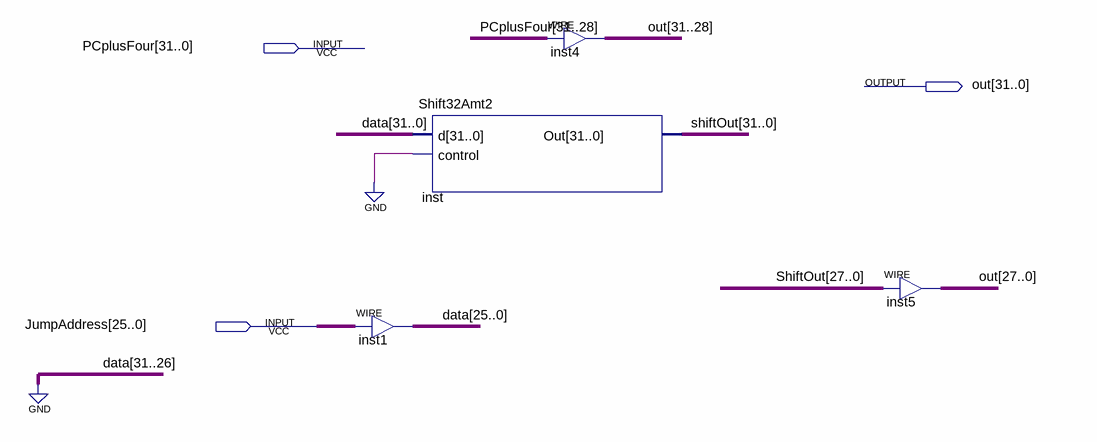
[diagram p0: schematic sheet]
// Quartus schematic Jump.bdf as structural Verilog: 4 symbols, 3 pins
module Jump (
  input  [31:0] PCplusFour,
  input  [25:0] JumpAddress,
  output [31:0] out
);

  wire [25:0] data;
  wire [31:0] shiftOut;

  assign data = JumpAddress;  // WIRE inst1
  Shift32Amt2 inst (.d({{6{1'b0}}, data}), .control(1'b0), .Out(shiftOut));
  assign out[31:28] = PCplusFour[31:28];  // WIRE inst4
  assign out[27:0] = shiftOut[27:0];  // WIRE inst5
endmodule
